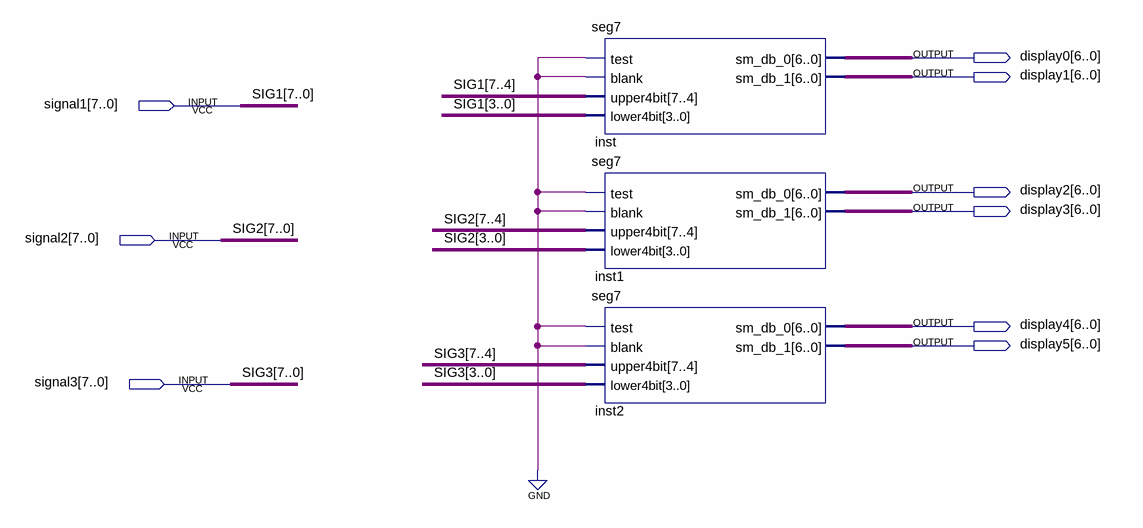
[diagram p0: schematic sheet]
// Quartus schematic display.bdf as structural Verilog: 3 symbols, 9 pins
module display (
  input  [7:0] signal1,
  input  [7:0] signal2,
  input  [7:0] signal3,
  output [6:0] display0,
  output [6:0] display1,
  output [6:0] display2,
  output [6:0] display3,
  output [6:0] display4,
  output [6:0] display5
);

  seg7 inst (
    .test(1'b0), .blank(1'b0), .upper4bit(signal1[7:4]), .lower4bit(signal1[3:0]), .sm_db_0(display0),
    .sm_db_1(display1));
  seg7 inst1 (
    .test(1'b0), .blank(1'b0), .upper4bit(signal2[7:4]), .lower4bit(signal2[3:0]), .sm_db_0(display2),
    .sm_db_1(display3));
  seg7 inst2 (
    .test(1'b0), .blank(1'b0), .upper4bit(signal3[7:4]), .lower4bit(signal3[3:0]), .sm_db_0(display4),
    .sm_db_1(display5));

  // Other names for the same wires on the sheet: SIG1[7:0] = signal1; SIG2[7:0] = signal2; SIG3[7:0] = signal3
endmodule
